# Altium schematic sheet 04-Peripheral Interface.SchDoc
size A4
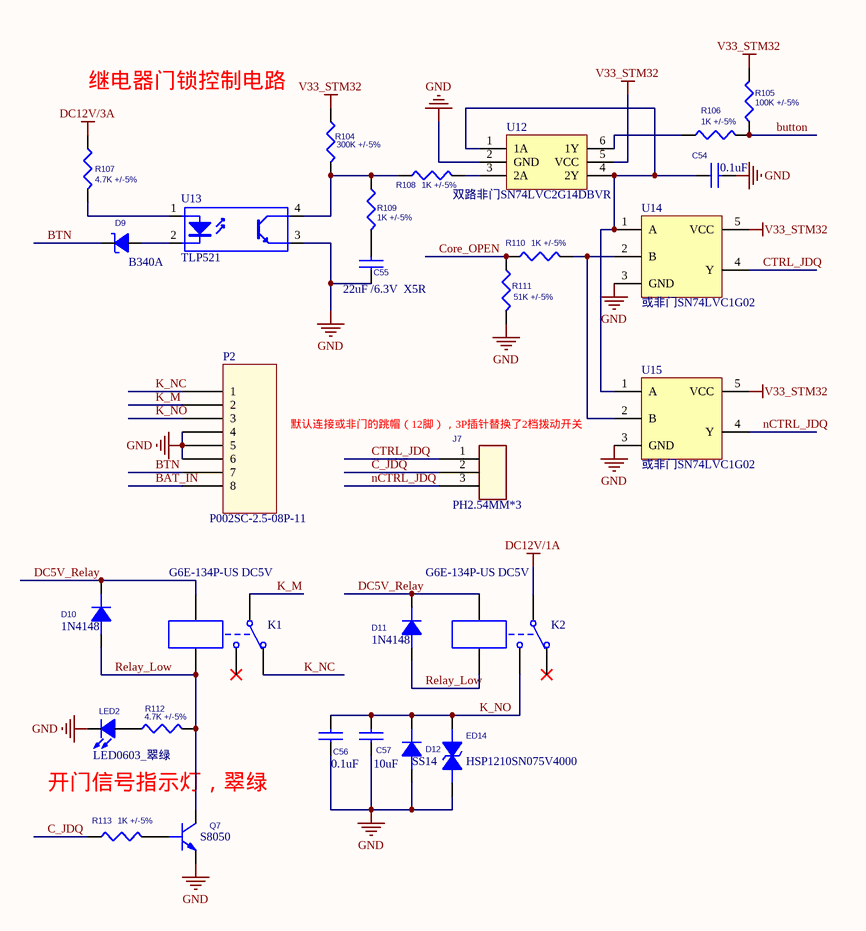
[diagram p0: 04-Peripheral Interface.SchDoc]

## Parts
C54  0.1uF  [C0402]
C55  22uF /6.3V  X5R  [C0805]
C56  0.1uF  [C0402]
C57  10uF  [C0603]
D9  B340A  [DO-214AC/SMA]
D10  1N4148  [SOD323]
D11  1N4148  [SOD323]
D12  SS14  [DO-214AA/SMB]
ED14  HSP1210SN075V4000  [ESD1210]
J7  PH2.54MM*3  [CON3]
K1  G6E-134P-US DC5V  [G6E134PUS]
K2  G6E-134P-US DC5V  [G6E134PUS]
LED2  LED0603_翠绿  [LED0603]
P2  P002SC-2.5-08P-11  [2EDGKD-2.5-8P]
Q7  S8050  [SOT23]
R104  300K +/-5%  [R0402]
R105  100K +/-5%  [R0402]
R106  1K +/-5%  [R0402]
R107  4.7K +/-5%  [R0402]
R108  1K +/-5%  [R0402]
R109  1K +/-5%  [R0402]
R110  1K +/-5%  [R0402]
R111  51K +/-5%  [R0402]
R112  4.7K +/-5%  [R0402]
R113  1K +/-5%  [R0402]
U12  双路非门SN74LVC2G14DBVR  [SOT23-6]
U13  TLP521  [SMD-4]
U14  或非门SN74LVC1G02  [SOT23-5]
U15  或非门SN74LVC1G02  [SOT23-5]

## Nets
DC12V/1A: K2.7
DC12V/3A: R107.1(R1)
GND: C54.2 C55.1 C56.1 C57.1 D12.1(A) ED14.1 LED2.1(CATHODE) P2.4 P2.5 P2.6 Q7.2(E) R111.2(R2) U12.2(GND) U13.3(E) U14.3(GND) U15.3(GND)
V33_STM32: R104.1(R1) R105.2(R2) U12.5(VCC) U14.5(VCC) U15.5(VCC)
BAT_IN: P2.8
BTN: D9.2(K) P2.7
button: R105.1(R1) R106.2(R2)
C_JDQ: J7.2 R113.1(R1)
Core_OPEN: R110.1(R1) R111.1(R1)
CTRL_JDQ: J7.1 U14.4(Y)
DC5V_Relay: D10.2(K) D11.2(K) K1.1 K2.1
K_M: K1.7 P2.2
K_NC: K1.10 P2.1
K_NO: C56.2 C57.2 D12.2(K) ED14.2 K2.12 P2.3
nCTRL_JDQ: J7.3 U15.4(Y)
Relay_Low: D10.1(A) D11.1(A) K1.6 K2.6 Q7.3(C) R112.2(R2)
NetC54_1: C54.1 U12.1(1A) U12.4(2Y) U14.1(A) U15.1(A)
NetC55_2: C55.2 R109.2(R2)
NetD9_1: D9.1(A) U13.2(K)
NetLED2_2: LED2.2(ANODE) R112.1(R1)
NetQ7_1: Q7.1(B) R113.2(R2)
NetR104_2: R104.2(R2) R108.1(R1) R109.1(R1) U13.4(C)
NetR106_1: R106.1(R1) U12.6(1Y)
NetR107_2: R107.2(R2) U13.1(A)
NetR108_2: R108.2(R2) U12.3(2A)
NetR110_2: R110.2(R2) U14.2(B) U15.2(B)

Not connected (* = marked no-connect by the designer): K1 12*; K2 10*

## Notes on the sheet
- 继电器门锁控制电路
- (near J7) 默认连接或非门的跳帽（12脚），3P插针替换了2档拨动开关
- 开门信号指示灯，翠绿

## Library data of the parts
C54 = CAP: 表贴无极电容 0.1uF +10/-10% X7R; value: 0.1uF
C55-C57 = CAP: RoHS CHIP CAP 0.1uF +10/-10% X7R
  C55: value: 22uF /6.3V  X5R
  C56: value: 0.1uF
  C57: value: 10uF
D9 = DIODE_Schottky-0: RoHS 0.5A SURFACE MOUNT SCHOTTKY BARRIER RECTIFIER 1N5819; VALUE: B340A
D10-D12 = DIODE: RoHS 0.5A SURFACE MOUNT SCHOTTKY BARRIER RECTIFIER 1N5819
  D10 D11: VALUE: 1N4148
  D12: VALUE: SS14
ED14 = ESD: AEM科技（苏州）股份有限公司西南区成都办事处    销售主管：张莉  电话18030573868; VALUE: HSP1210SN075V4000
J7 = CON3: 2.54mm单排插针，默认短接靠近或非门字样的1 2脚; value: PH2.54MM*3
K1 K2 = Relay-SPDT: https://item.taobao.com/item.htm?spm=a1z09.2.0.0.8b3ce33OERfgM&id=552384788811&_u=mb0qso78504; Published: 24-Mar-1999; LatestRevisionDate: 17-Jul-2002; LatestRevisionNote: Re-released for DXP Platform.; PackageReference: MODULE5B; Publisher: Altium Limited
LED2 = LED: 0603LED指示灯，颜色不同; value: LED0603_翠绿
P2 = 2EDGKD-2.5-8P: 门禁8P连接座，成都联益都电子有限公司，联系电话17780015645，邮箱lyconn107@163.com; value: P002SC-2.5-08P-11
Q7 = NPN: value: S8050
R104-R113 = RES
  R104: value: 300K +/-5%
  R105: value: 100K +/-5%
  R106 R108-R110 R113: value: 1K +/-5%
  R107 R112: value: 4.7K +/-5%
  R111: value: 51K +/-5%
U12 = SN74LVC2G14DBVR: 2路反相器    文晔集团    王忠凯，13823710380; Designer: Beyond@MXJ
U13 = TLP521: TLP521 SMD-4    安森美或者东芝品牌; Designer: BEYOND@MXJ
U14 = Single 2-input: 单路 2 输入逻辑门    文晔集团    王忠凯，13823710380; Designer: Beyond@MXJ
U15 = Single 2-input: 单路 2 输入逻辑门     文晔集团    王忠凯，13823710380; Designer: Beyond@MXJ